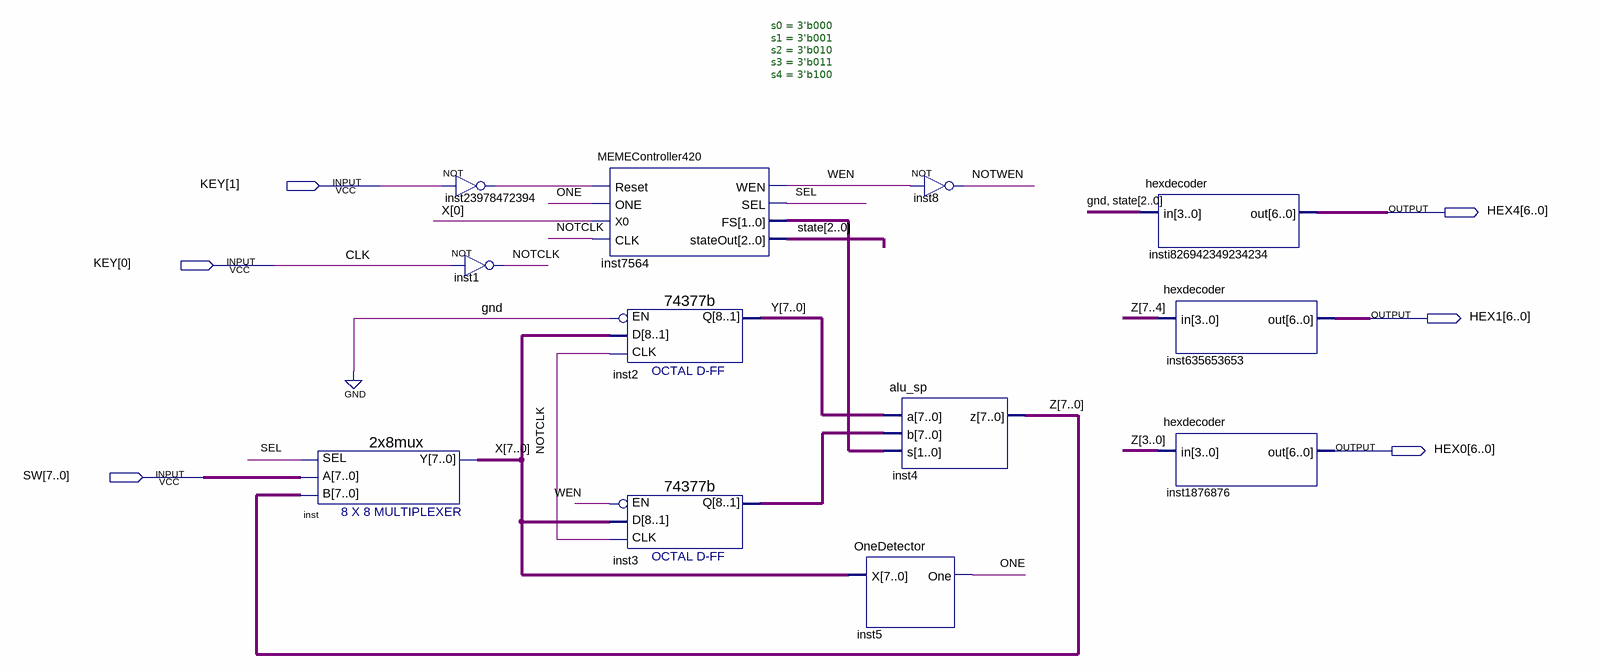
[diagram p0: schematic sheet]
// Quartus schematic StateMachine.bdf as structural Verilog: 12 symbols, 6 pins
module StateMachine (
  input  [1:0] KEY,
  input  [7:0] SW,
  output [6:0] HEX4,
  output [6:0] HEX1,
  output [6:0] HEX0
);

  wire inst23978472394_out, NOTCLK, NOTWEN, ONE, SEL, WEN;
  wire [1:0] inst7564_fs;
  wire [2:0] state;
  wire [7:0] inst3_q, X, Y, Z;

  \2x8mux  inst (.SEL(SEL), .A(SW), .B(Z), .Y(X));
  not inst23978472394 (inst23978472394_out, KEY[1]);
  not inst1 (NOTCLK, KEY[0]);
  MEMEController420 #(.s0(3'b000), .s1(3'b001), .s2(3'b010), .s3(3'b011), .s4(3'b100)) inst7564 (
    .Reset(inst23978472394_out), .ONE(ONE), .X0(X[0]), .CLK(NOTCLK), .WEN(WEN), .SEL(SEL), .FS(inst7564_fs),
    .stateOut(state));
  \74377b  inst2 (.CLK(NOTCLK), .EN(1'b0), .D(X), .Q(Y));
  \74377b  inst3 (.CLK(NOTCLK), .EN(WEN), .D(X), .Q(inst3_q));
  alu_sp inst4 (.a(Y), .b(inst3_q), .s(inst7564_fs), .z(Z));
  OneDetector inst5 (.X(X), .One(ONE));
  not inst8 (NOTWEN, WEN);
  hexdecoder insti826942349234234 (.in({1'b0, state}), .out(HEX4));
  hexdecoder inst635653653 (.in(Z[7:4]), .out(HEX1));
  hexdecoder inst1876876 (.in(Z[3:0]), .out(HEX0));

  // Other names for the same wires on the sheet: CLK = KEY[0]
endmodule
